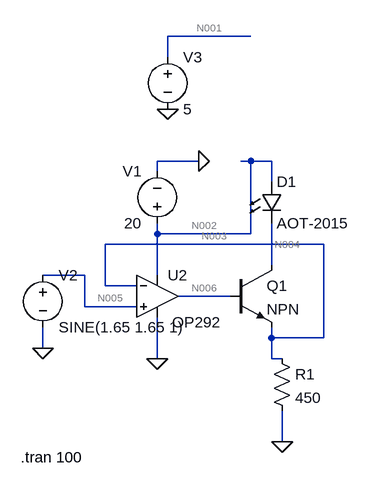
[diagram p0: schematic current source.asc]
current source.asc, the LTspice schematic file:
Version 4
SHEET 1 880 680
WIRE 240 -240 112 -240
WIRE 112 -208 112 -240
WIRE 160 -48 96 -48
WIRE 240 -48 224 -48
WIRE 272 -48 240 -48
WIRE 96 -32 96 -48
WIRE 272 -16 272 -48
WIRE 96 64 96 48
WIRE 240 64 240 -48
WIRE 240 64 96 64
WIRE 352 80 16 80
WIRE 272 112 272 48
WIRE -16 128 -80 128
WIRE 96 128 96 64
WIRE 16 144 16 80
WIRE 64 144 16 144
WIRE 208 160 128 160
WIRE -16 176 -16 128
WIRE 64 176 -16 176
WIRE 272 224 272 208
WIRE 352 224 352 80
WIRE 352 224 272 224
WIRE -80 240 -80 208
WIRE 96 256 96 192
WIRE 272 256 272 224
WIRE 288 256 272 256
WIRE 288 384 288 336
FLAG 96 256 0
FLAG -80 240 0
FLAG 160 -48 0
FLAG 288 384 0
FLAG 112 -128 0
SYMBOL npn 208 112 R0
SYMATTR InstName Q1
SYMBOL res 272 240 R0
SYMATTR InstName R1
SYMATTR Value 450
SYMBOL voltage 96 64 R180
WINDOW 0 24 96 Left 2
WINDOW 3 24 16 Left 2
WINDOW 123 0 0 Left 0
WINDOW 39 0 0 Left 0
SYMATTR InstName V1
SYMATTR Value 20
SYMBOL voltage -80 112 R0
WINDOW 123 24 124 Left 2
WINDOW 39 0 0 Left 0
SYMATTR InstName V2
SYMATTR Value SINE(1.65 1.65 1)
SYMBOL LED 256 -16 R0
SYMATTR InstName D1
SYMATTR Value AOT-2015
SYMBOL voltage 112 -224 R0
WINDOW 123 0 0 Left 0
WINDOW 39 0 0 Left 0
SYMATTR InstName V3
SYMATTR Value 5
SYMBOL OpAmps\\OP292 96 96 R0
WINDOW 3 23 104 Left 2
SYMATTR InstName U2
TEXT -114 408 Left 2 !.tran 100

The netlist it stands for:
* current source.asc
Q1 N004 N006 N003 0 NPN
R1 N003 0 450
V1 N002 0 20
V2 N005 0 SINE(1.65 1.65 1)
D1 N002 N004 AOT-2015
V3 N001 0 5
XU2 N005 N003 N002 0 N006 OP292  ; pins In+ In- V+ V- OUT
.model D D
.lib standard.dio
.model NPN NPN
.model PNP PNP
.lib standard.bjt
.tran 100
.lib ADI1.lib
.backanno
.end

* Results of the author's LTspice run, read from the files saved beside the schematic
* Operating Point, zero values left out:
*   V(n004) = 17.48 V
*   V(n006) = 2.457 V
*   V(n003) = 1.649 V
*   V(n002) = 20 V
*   V(n005) = 1.65 V
*   V(n001) = 5 V
*   Ic(Q1) = 3.628 mA
*   Ib(Q1) = 36.28 µA
*   Ie(Q1) = -3.664 mA
*   I(D1) = 3.628 mA
*   I(R1) = 3.665 mA
*   I(V2) = 390.1 nA
*   I(V1) = -4.661 mA
*   Ix(u2:2) = -390.1 nA
*   Ix(u2:1) = -409.9 nA
*   Ix(u2:99) = 1.033 mA
*   Ix(u2:50) = -996.2 µA
*   Ix(u2:34) = -36.28 µA
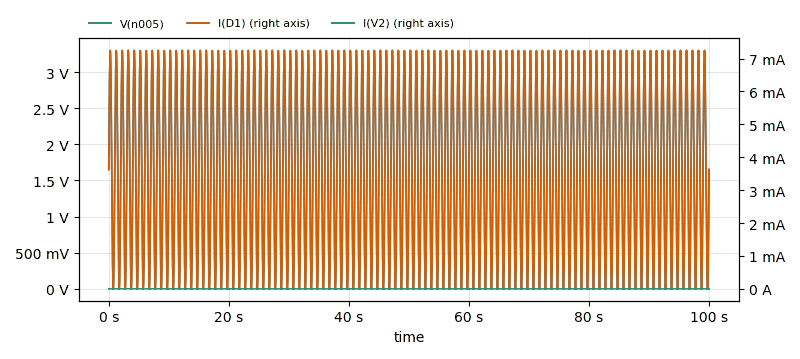
[diagram p1: Transient Analysis of current source.asc, plotted from the saved traces]
* Transient Analysis, 1 run:
*   V(n005): min 375 nV, max 3.3 V, average 1.648 V, rms 2.031 V, last 1.65 V
*   I(D1): min 0 A, max 7.25 mA, average 3.613 mA, rms 4.436 mA, last 3.628 mA
*   I(V2): min 389.5 nA, max 393.6 nA, average 390.1 nA, rms 390.1 nA, last 390.1 nA